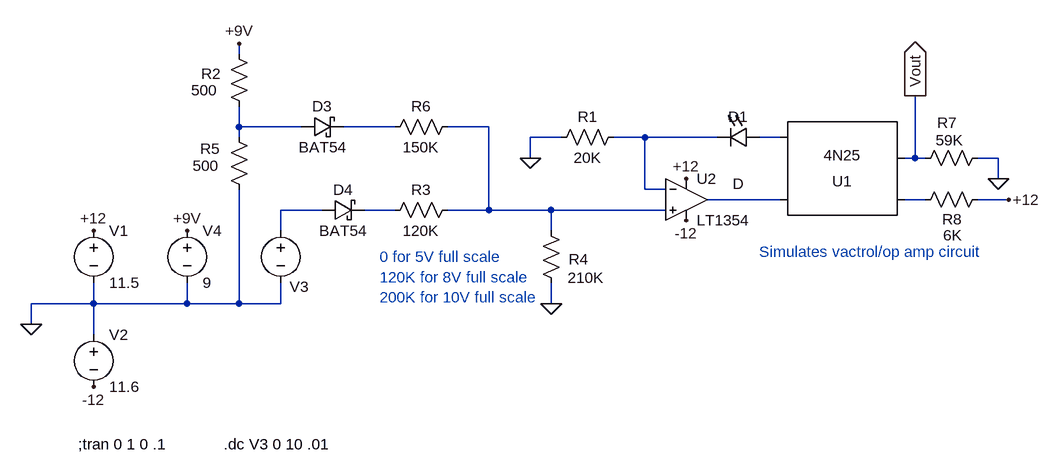
[diagram p0: schematic VCA.asc]
VCA.asc, the LTspice schematic file:
Version 4
SHEET 1 1424 680
WIRE 176 -240 176 -256
WIRE 176 -128 176 -160
WIRE 272 -128 176 -128
WIRE 416 -128 336 -128
WIRE 560 -128 496 -128
WIRE 176 -112 176 -128
WIRE 672 -112 624 -112
WIRE 800 -112 752 -112
WIRE 912 -112 800 -112
WIRE 1008 -112 976 -112
WIRE 624 -80 624 -112
WIRE 1216 -80 1216 -176
WIRE 1216 -80 1200 -80
WIRE 1232 -80 1216 -80
WIRE 1344 -80 1312 -80
WIRE 1344 -48 1344 -80
WIRE 800 -32 800 -112
WIRE 832 -32 800 -32
WIRE 1008 -16 896 -16
WIRE 1232 -16 1200 -16
WIRE 1360 -16 1312 -16
WIRE 304 0 240 0
WIRE 416 0 368 0
WIRE 560 0 560 -128
WIRE 560 0 496 0
WIRE 656 0 560 0
WIRE 832 0 656 0
WIRE 240 32 240 0
WIRE 656 32 656 0
WIRE -48 144 -48 112
WIRE -48 144 -144 144
WIRE 96 144 96 112
WIRE 96 144 -48 144
WIRE 176 144 176 -32
WIRE 176 144 96 144
WIRE 240 144 240 112
WIRE 240 144 176 144
WIRE 656 144 656 112
WIRE -144 176 -144 144
WIRE -48 192 -48 144
FLAG -144 176 0
FLAG -48 32 +12
FLAG -48 272 -12
FLAG 864 -48 +12
FLAG 864 16 -12
FLAG 656 144 0
FLAG 624 -80 0
FLAG 96 32 +9V
FLAG 176 -256 +9V
FLAG 1360 -16 +12
FLAG 1344 -48 0
FLAG 1216 -176 Vout
IOPIN 1216 -176 Out
SYMBOL voltage -48 16 R0
WINDOW 123 0 0 Left 0
WINDOW 39 0 0 Left 0
SYMATTR InstName V1
SYMATTR Value 11.5
SYMBOL voltage -48 176 R0
WINDOW 123 0 0 Left 0
WINDOW 39 0 0 Left 0
SYMATTR InstName V2
SYMATTR Value 11.6
SYMBOL voltage 240 16 R0
WINDOW 3 -105 105 Invisible 2
WINDOW 123 0 0 Left 0
WINDOW 0 14 102 Left 2
SYMATTR Value SINE(5 4 1 0.00001 0.00001)
SYMATTR InstName V3
SYMATTR SpiceLine Rser=0
SYMBOL res 512 -16 R90
WINDOW 0 0 56 VBottom 2
WINDOW 3 32 56 VTop 2
SYMATTR InstName R3
SYMATTR Value 120K
SYMBOL res 672 128 R180
WINDOW 0 -42 52 Left 2
WINDOW 3 -66 24 Left 2
SYMATTR InstName R4
SYMATTR Value 210K
SYMBOL OpAmps\\LT1354 864 -80 R0
SYMATTR InstName U2
SYMBOL voltage 96 16 R0
WINDOW 123 0 0 Left 0
WINDOW 39 0 0 Left 0
SYMATTR InstName V4
SYMATTR Value 9
SYMBOL LED 976 -128 R90
WINDOW 0 0 32 VBottom 2
WINDOW 3 72 32 VTop 2
SYMATTR InstName D1
SYMBOL res 768 -128 R90
WINDOW 0 0 56 VBottom 2
WINDOW 3 32 56 VTop 2
SYMATTR InstName R1
SYMATTR Value 20K
SYMBOL res 192 -144 R180
WINDOW 0 44 66 Left 2
WINDOW 3 49 40 Left 2
SYMATTR InstName R2
SYMATTR Value 500
SYMBOL res 192 -16 R180
WINDOW 0 45 78 Left 2
WINDOW 3 47 52 Left 2
SYMATTR InstName R5
SYMATTR Value 500
SYMBOL res 512 -144 R90
WINDOW 0 0 56 VBottom 2
WINDOW 3 32 56 VTop 2
SYMATTR InstName R6
SYMATTR Value 150K
SYMBOL schottky 272 -112 R270
WINDOW 0 32 32 VTop 2
WINDOW 3 0 32 VBottom 2
SYMATTR InstName D3
SYMATTR Value BAT54
SYMATTR Description Diode
SYMATTR Type diode
SYMBOL schottky 304 16 R270
WINDOW 0 32 32 VTop 2
WINDOW 3 0 32 VBottom 2
SYMATTR InstName D4
SYMATTR Value BAT54
SYMATTR Description Diode
SYMATTR Type diode
SYMBOL Optos\\4N25 1104 -80 M180
SYMATTR InstName U1
SYMBOL res 1328 -96 R90
WINDOW 0 -23 63 VBottom 2
WINDOW 3 -27 59 VTop 2
SYMATTR InstName R7
SYMATTR Value 59K
SYMBOL res 1328 -32 R90
WINDOW 0 62 55 VBottom 2
WINDOW 3 55 54 VTop 2
SYMATTR InstName R8
SYMATTR Value 6K
TEXT -72 360 Left 2 !;tran 0 1 0 .1
TEXT 152 360 Left 2 !.dc V3 0 10 .01
TEXT 392 72 Left 2 ;0 for 5V full scale\n120K for 8V full scale\n200K for 10V full scale
TEXT 976 64 Left 2 ;Simulates vactrol/op amp circuit

The netlist it stands for:
* VCA.asc
V1 +12 0 11.5
V2 0 -12 11.6
V3 N008 0 SINE(5 4 1 0.00001 0.00001) Rser=0
R3 N003 N009 120K
R4 0 N003 210K
XU2 N003 N004 +12 -12 N006 LT1354  ; pins In+ In- V+ V- OUT
V4 +9V 0 9
D1 N005 N004 D
R1 N004 0 20K
R2 N001 +9V 500
R5 0 N001 500
R6 N003 N002 150K
D3 N001 N002 BAT54
D4 N008 N009 BAT54
XU1 N006 N005 N007 Vout NC_01 4N25
R7 0 Vout 59K
R8 +12 N007 6K
.model D D
.lib standard.dio
;tran 0 1 0 .1
.dc V3 0 10 .01
* 0 for 5V full scale
* 120K for 8V full scale
* 200K for 10V full scale
* Simulates vactrol/op amp circuit
.lib 4N25.sub
.backanno
.end

* Results of the author's LTspice run, read from the files saved beside the schematic
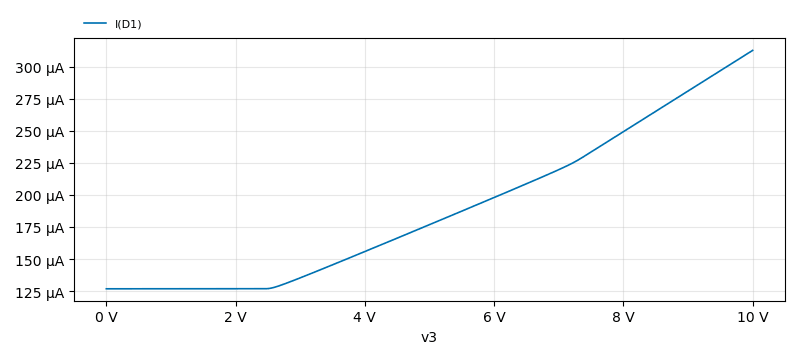
[diagram p1: DC transfer characteristic of VCA.asc, plotted from the saved traces]
* DC transfer characteristic, 1 run:
*   I(D1): 126.8 µA at v3=0 V, 312.8 µA at v3=10 V, min 126.8 µA, max 312.8 µA